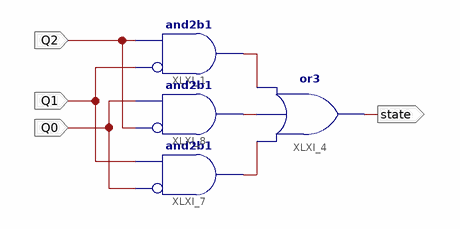
[diagram p0: schematic sheet 1]
// Xilinx ISE schematic StateLoad.sch (spartan3e) as structural Verilog: 4 symbols, 4 ports
module StateLoad (
  input  Q2,
  input  Q0,
  input  Q1,
  output state
);

  wire XLXN_1, XLXN_2, XLXN_3;

  or XLXI_4 (state, XLXN_3, XLXN_2, XLXN_1);
  and XLXI_1 (XLXN_1, ~Q1, Q2);  // and2b1
  and XLXI_7 (XLXN_3, ~Q0, Q1);  // and2b1
  and XLXI_8 (XLXN_2, ~Q2, Q0);  // and2b1
endmodule
